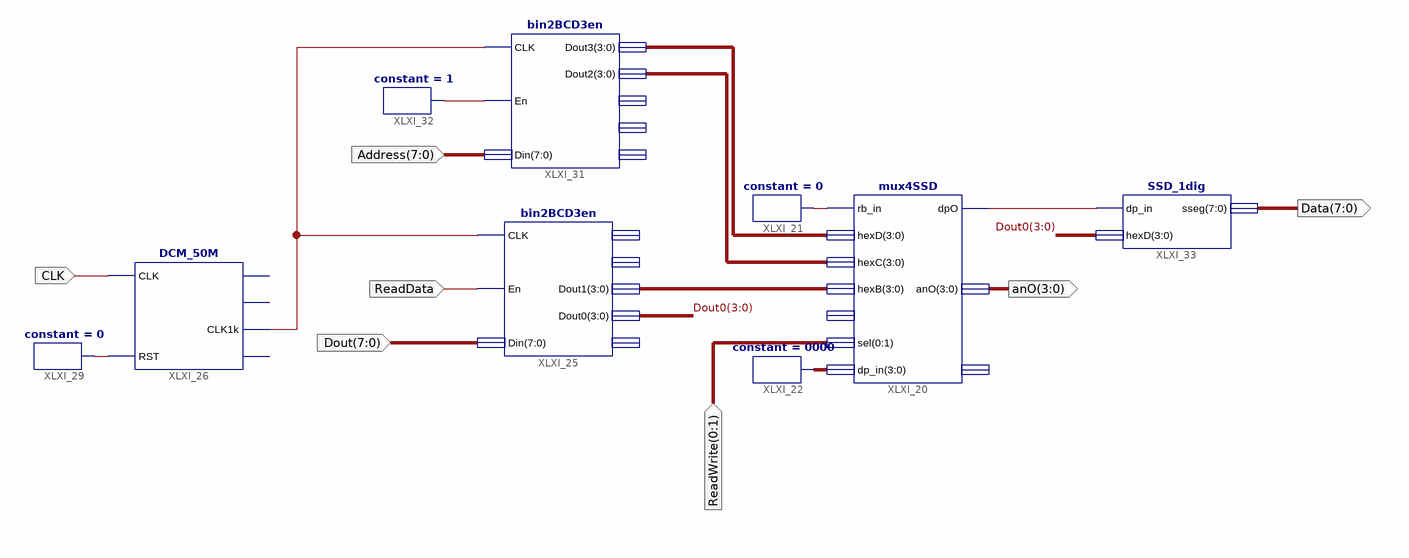
[diagram p0: schematic sheet 1]
// Xilinx ISE schematic ADDisplay.sch (spartan3e) as structural Verilog: 9 symbols, 7 ports
module ADDisplay (
  input  ReadData,
  input  CLK,
  input  [7:0] Dout,
  input  [7:0] Address,
  input  [0:1] ReadWrite,
  output [3:0] anO,
  output [7:0] Data
);

  wire XLXN_58, XLXN_75, XLXN_77, XLXN_80, XLXN_81;
  wire [3:0] Dout0, XLXN_59, XLXN_70, XLXN_78, XLXN_79;

  mux4SSD XLXI_20 (
    .rb_in(XLXN_58), .hexD(XLXN_78), .hexC(XLXN_79), .hexB(XLXN_70), .sel(ReadWrite), .dp_in(XLXN_59),
    .dpO(XLXN_81), .anO(anO));  // open: hexA, hexO
  constant #(.CValue("0")) XLXI_21 (.O(XLXN_58));
  constant #(.CValue("0000")) XLXI_22 (.O(XLXN_59));
  bin2BCD3en XLXI_25 (
    .CLK(XLXN_75), .En(ReadData), .Din(Dout), .Dout1(XLXN_70), .Dout0(Dout0));  // open: Dout3, Dout2, RBout
  DCM_50M XLXI_26 (.CLK(CLK), .RST(XLXN_77), .CLK1k(XLXN_75));  // open: CLK1M, CLK10k, CLK1
  constant #(.CValue("0")) XLXI_29 (.O(XLXN_77));
  bin2BCD3en XLXI_31 (
    .CLK(XLXN_75), .En(XLXN_80), .Din(Address), .Dout3(XLXN_78), .Dout2(XLXN_79));  // open: Dout1, Dout0, RBout
  constant #(.CValue("1")) XLXI_32 (.O(XLXN_80));
  SSD_1dig XLXI_33 (.dp_in(XLXN_81), .hexD(Dout0), .sseg(Data));
endmodule
